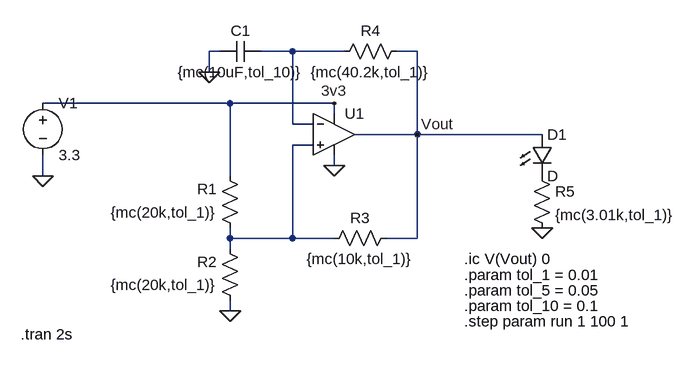
[diagram p0: schematic relaxation_oscillator.asc]
relaxation_oscillator.asc, the LTspice schematic file:
Version 4
SHEET 1 880 680
WIRE -208 32 -224 32
WIRE -96 32 -144 32
WIRE -16 32 -96 32
WIRE 96 32 64 32
WIRE -224 64 -224 32
WIRE -192 112 -480 112
WIRE -32 112 -192 112
WIRE -32 128 -32 112
WIRE -96 144 -96 32
WIRE -64 144 -96 144
WIRE 96 160 96 32
WIRE 96 160 0 160
WIRE 288 160 96 160
WIRE -64 176 -96 176
WIRE -32 208 -32 192
WIRE -480 224 -480 192
WIRE -192 224 -192 112
WIRE -192 320 -192 304
WIRE -96 320 -96 176
WIRE -96 320 -192 320
WIRE -32 320 -96 320
WIRE 96 320 96 160
WIRE 96 320 48 320
WIRE -192 336 -192 320
WIRE -192 432 -192 416
FLAG -224 64 0
FLAG -192 432 0
FLAG -32 208 0
FLAG -32 112 3v3
FLAG -480 224 0
FLAG 96 160 Vout
FLAG 288 304 0
SYMBOL res -176 320 R180
WINDOW 0 36 76 Left 2
WINDOW 3 36 40 Left 2
SYMATTR InstName R1
SYMATTR Value {mc(20k,tol_1)}
SYMBOL res -176 432 R180
WINDOW 0 36 76 Left 2
WINDOW 3 36 40 Left 2
SYMATTR InstName R2
SYMATTR Value {mc(20k,tol_1)}
SYMBOL cap -144 16 R90
WINDOW 0 0 32 VBottom 2
WINDOW 3 32 32 VTop 2
SYMATTR InstName C1
SYMATTR Value {mc(10uF,tol_10)}
SYMBOL res 80 16 R90
WINDOW 0 0 56 VBottom 2
WINDOW 3 32 56 VTop 2
SYMATTR InstName R4
SYMATTR Value {mc(40.2k,tol_1)}
SYMBOL res 64 304 R90
WINDOW 0 0 56 VBottom 2
WINDOW 3 32 56 VTop 2
SYMATTR InstName R3
SYMATTR Value {mc(10k,tol_1)}
SYMBOL voltage -480 96 R0
WINDOW 123 0 0 Left 2
WINDOW 39 0 0 Left 2
SYMATTR InstName V1
SYMATTR Value 3.3
SYMBOL Opamps\\UniversalOpamp2 -32 160 R0
SYMATTR InstName U1
SYMBOL res 272 208 R0
SYMATTR InstName R5
SYMATTR Value {mc(3.01k,tol_1)}
SYMBOL LED 272 160 R0
SYMATTR InstName D1
TEXT 168 376 Left 2 !.param tol_1 = 0.01
TEXT 168 400 Left 2 !.param tol_5 = 0.05
TEXT 168 424 Left 2 !.param tol_10 = 0.1
TEXT 168 448 Left 2 !.step param run 1 100 1
TEXT -514 468 Left 2 !.tran 2s
TEXT 168 352 Left 2 !.ic V(Vout) 0

The netlist it stands for:
* relaxation_oscillator.asc
R1 N002 3v3 {mc(20k,tol_1)}
R2 0 N002 {mc(20k,tol_1)}
C1 N001 0 {mc(10uF,tol_10)}
R4 Vout N001 {mc(40.2k,tol_1)}
R3 Vout N002 {mc(10k,tol_1)}
V1 3v3 0 3.3
XU1 N002 N001 3v3 0 Vout level.2 Avol=1Meg GBW=10Meg Slew=10Meg ilimit=25m rail=0 Vos=0 phimargin=45 en=0 enk=0 in=0 ink=0 Rin=500Meg  ; pins IN+ IN- V+ V- OUT
R5 P001 0 {mc(3.01k,tol_1)}
D1 Vout P001 D
.model D D
.lib standard.dio
.param tol_1 = 0.01
.param tol_5 = 0.05
.param tol_10 = 0.1
.step param run 1 100 1
.tran 2s
.ic V(Vout) 0
.lib UniversalOpamps2.sub
.backanno
.end